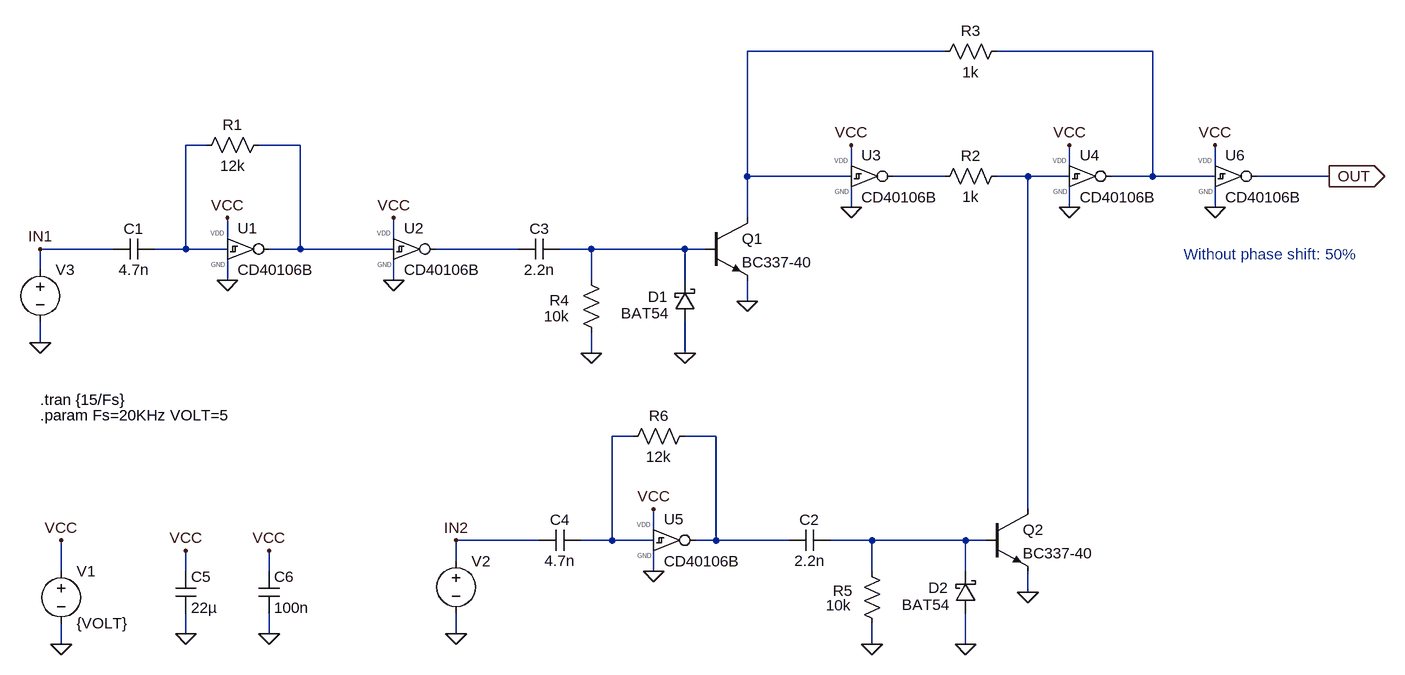
[diagram p0: schematic v1.1.asc]
v1.1.asc, the LTspice schematic file:
Version 4.1
SHEET 1 1820 1108
WIRE 1072 48 768 48
WIRE 1392 48 1152 48
WIRE -64 192 -96 192
WIRE 80 192 16 192
WIRE 928 224 928 192
WIRE 1264 224 1264 192
WIRE 1488 224 1488 192
WIRE 768 240 768 48
WIRE 928 240 768 240
WIRE 1072 240 992 240
WIRE 1200 240 1152 240
WIRE 1264 240 1200 240
WIRE 1392 240 1392 48
WIRE 1392 240 1328 240
WIRE 1488 240 1392 240
WIRE 1664 240 1552 240
WIRE 928 288 928 256
WIRE 1264 288 1264 256
WIRE 1488 288 1488 256
WIRE 768 304 768 240
WIRE -32 336 -32 304
WIRE 224 336 224 304
WIRE -208 352 -320 352
WIRE -96 352 -96 192
WIRE -96 352 -144 352
WIRE -32 352 -96 352
WIRE 80 352 80 192
WIRE 80 352 32 352
WIRE 224 352 80 352
WIRE 416 352 288 352
WIRE 528 352 480 352
WIRE 672 352 528 352
WIRE 704 352 672 352
WIRE -320 384 -320 352
WIRE -32 400 -32 368
WIRE 224 400 224 368
WIRE 528 400 528 352
WIRE 672 400 672 352
WIRE 768 432 768 400
WIRE -320 496 -320 464
WIRE 528 512 528 480
WIRE 672 512 672 464
WIRE 592 640 560 640
WIRE 720 640 672 640
WIRE 1200 752 1200 240
WIRE 624 784 624 752
WIRE 448 800 320 800
WIRE 560 800 560 640
WIRE 560 800 512 800
WIRE 624 800 560 800
WIRE 720 800 720 640
WIRE 720 800 688 800
WIRE 832 800 720 800
WIRE 960 800 896 800
WIRE 1104 800 960 800
WIRE 1136 800 1104 800
WIRE 320 832 320 800
WIRE -288 848 -288 800
WIRE -96 848 -96 816
WIRE 32 848 32 816
WIRE 624 848 624 816
WIRE 960 848 960 800
WIRE 1104 848 1104 800
WIRE 1200 880 1200 848
WIRE -96 944 -96 912
WIRE 32 944 32 912
WIRE 320 944 320 912
WIRE -288 960 -288 928
WIRE 960 960 960 928
WIRE 1104 960 1104 912
FLAG -288 960 0
FLAG -288 800 VCC
FLAG -32 400 0
FLAG -32 304 VCC
FLAG -320 496 0
FLAG -320 352 IN1
FLAG 1664 240 OUT
IOPIN 1664 240 Out
FLAG 768 432 0
FLAG 928 288 0
FLAG 928 192 VCC
FLAG 1264 288 0
FLAG 1264 192 VCC
FLAG 1104 960 0
FLAG 1200 880 0
FLAG 320 944 0
FLAG 320 800 IN2
FLAG 672 512 0
FLAG 624 848 0
FLAG 624 752 VCC
FLAG 224 400 0
FLAG 224 304 VCC
FLAG 1488 288 0
FLAG 1488 192 VCC
FLAG -96 944 0
FLAG 32 944 0
FLAG -96 816 VCC
FLAG 32 816 VCC
FLAG 528 512 0
FLAG 960 960 0
SYMBOL voltage -288 832 R0
WINDOW 123 0 0 Left 0
WINDOW 39 0 0 Left 0
SYMATTR InstName V1
SYMATTR Value {VOLT}
SYMBOL voltage -320 368 R0
WINDOW 3 41 64 Invisible 2
WINDOW 123 0 0 Left 0
WINDOW 39 0 0 Left 0
SYMATTR Value PULSE(0 {VOLT} 0 1n 1n {0.5/Fs} {1/Fs})
SYMATTR InstName V3
SYMBOL cap -208 368 R270
WINDOW 0 32 32 VTop 2
WINDOW 3 0 32 VBottom 2
SYMATTR InstName C1
SYMATTR Value 4.7n
SYMBOL res 32 176 R90
WINDOW 0 0 56 VBottom 2
WINDOW 3 32 56 VTop 2
SYMATTR InstName R1
SYMATTR Value 12k
SYMBOL npn 704 304 R0
SYMATTR InstName Q1
SYMATTR Value BC337-40
SYMBOL res 1056 256 R270
WINDOW 0 32 56 VTop 2
WINDOW 3 0 56 VBottom 2
SYMATTR InstName R2
SYMATTR Value 1k
SYMBOL res 1168 32 R90
WINDOW 0 0 56 VBottom 2
WINDOW 3 32 56 VTop 2
SYMATTR InstName R3
SYMATTR Value 1k
SYMBOL cap 832 816 R270
WINDOW 0 32 32 VTop 2
WINDOW 3 0 32 VBottom 2
SYMATTR InstName C2
SYMATTR Value 2.2n
SYMBOL res 944 832 R0
WINDOW 0 -44 46 Left 2
WINDOW 3 -55 68 Left 2
SYMATTR InstName R5
SYMATTR Value 10k
SYMBOL npn 1136 752 R0
SYMATTR InstName Q2
SYMATTR Value BC337-40
SYMBOL voltage 320 816 R0
WINDOW 3 41 64 Invisible 2
WINDOW 123 0 0 Left 0
WINDOW 39 0 0 Left 0
SYMATTR Value PULSE(0 {VOLT} {0.25/Fs} 1n 1n {0.5/Fs} {1/Fs})
SYMATTR InstName V2
SYMBOL cap 416 368 R270
WINDOW 0 32 32 VTop 2
WINDOW 3 0 32 VBottom 2
SYMATTR InstName C3
SYMATTR Value 2.2n
SYMBOL res 512 384 R0
WINDOW 0 -48 47 Left 2
WINDOW 3 -57 71 Left 2
SYMATTR InstName R4
SYMATTR Value 10k
SYMBOL cap 448 816 R270
WINDOW 0 32 32 VTop 2
WINDOW 3 0 32 VBottom 2
SYMATTR InstName C4
SYMATTR Value 4.7n
SYMBOL res 688 624 R90
WINDOW 0 0 56 VBottom 2
WINDOW 3 32 56 VTop 2
SYMATTR InstName R6
SYMATTR Value 12k
SYMBOL MyLib\\Digital\\CD40106B -32 320 R0
SYMATTR InstName U1
SYMBOL MyLib\\Digital\\CD40106B 224 320 R0
SYMATTR InstName U2
SYMBOL MyLib\\Digital\\CD40106B 928 208 R0
SYMATTR InstName U3
SYMBOL MyLib\\Digital\\CD40106B 1264 208 R0
SYMATTR InstName U4
SYMBOL MyLib\\Digital\\CD40106B 624 768 R0
SYMATTR InstName U5
SYMBOL MyLib\\Digital\\CD40106B 1488 208 R0
SYMATTR InstName U6
SYMBOL cap -112 848 R0
SYMATTR InstName C5
SYMATTR Value 22µ
SYMBOL cap 16 848 R0
SYMATTR InstName C6
SYMATTR Value 100n
SYMBOL schottky 656 464 M180
WINDOW 0 -41 39 Left 2
WINDOW 3 -82 13 Left 2
SYMATTR InstName D1
SYMATTR Value BAT54
SYMBOL schottky 1088 912 M180
WINDOW 0 -41 39 Left 2
WINDOW 3 -82 13 Left 2
SYMATTR InstName D2
SYMATTR Value BAT54
TEXT -320 608 Left 2 !.param Fs=20KHz VOLT=5
TEXT -320 584 Left 2 !.tran {15/Fs}
TEXT 1440 360 Left 2 ;Without phase shift: 50%

The netlist it stands for:
* v1.1.asc
V1 VCC 0 {VOLT}
V3 IN1 0 PULSE(0 {VOLT} 0 1n 1n {0.5/Fs} {1/Fs})
C1 IN1 N003 4.7n
R1 N004 N003 12k
Q1 N001 N008 0 0 BC337-40
R2 N005 N006 1k
R3 N002 N001 1k
C2 N010 N011 2.2n
R5 N011 0 10k
Q2 N006 N011 0 0 BC337-40
V2 IN2 0 PULSE(0 {VOLT} {0.25/Fs} 1n 1n {0.5/Fs} {1/Fs})
C3 N007 N008 2.2n
R4 N008 0 10k
C4 IN2 N009 4.7n
R6 N010 N009 12k
X§U1 N003 N004 VCC 0 CD40106B vdd=5 speed=2 tripdt=100n  ; pins in out VDD GND
X§U2 N004 N007 VCC 0 CD40106B vdd=5 speed=2 tripdt=100n  ; pins in out VDD GND
X§U3 N001 N005 VCC 0 CD40106B vdd=5 speed=2 tripdt=100n  ; pins in out VDD GND
X§U4 N006 N002 VCC 0 CD40106B vdd=5 speed=2 tripdt=100n  ; pins in out VDD GND
X§U5 N009 N010 VCC 0 CD40106B vdd=5 speed=2 tripdt=100n  ; pins in out VDD GND
X§U6 N002 OUT VCC 0 CD40106B vdd=5 speed=2 tripdt=100n  ; pins in out VDD GND
C5 VCC 0 22µ
C6 VCC 0 100n
D1 0 N008 BAT54
D2 0 N011 BAT54
.model D D
.lib standard.dio
.model NPN NPN
.model PNP PNP
.lib standard.bjt
.param Fs=20KHz VOLT=5
.tran {15/Fs}
* Without phase shift: 50%
.lib MyLib/Digital/_CD4xxx.lib
.backanno
.end